# Altium schematic sheet salinity.SchDoc
size A4
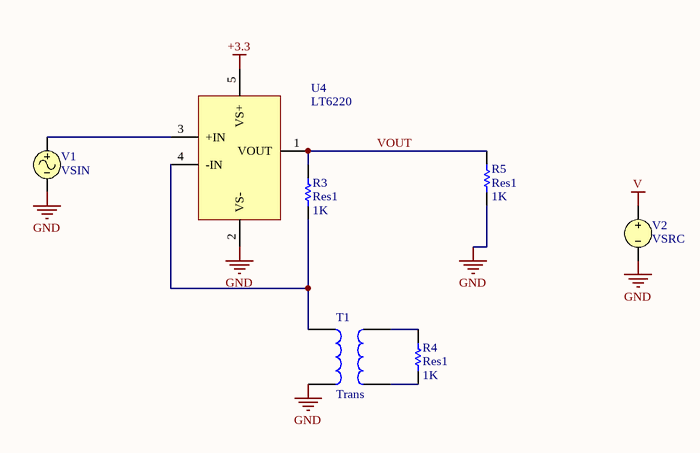
[diagram p0: salinity.SchDoc]

## Parts
R3  Res1  value 1K  [AXIAL-0.3]
R4  Res1  value 1K  [AXIAL-0.3]
R5  Res1  value 1K  [AXIAL-0.3]
T1  Trans  [TRANS]
U4  LT6220
V1  VSIN
V2  VSRC

## Nets
+3.3: U4.5(VS+)
GND: R5.1 T1.2 U4.2(VS-) V1.2 V2.2
V: V2.1
VOUT: R3.2 R5.2 U4.1(VOUT)
NetR3_1: R3.1 T1.1 U4.4(-IN)
NetR4_1: R4.1 T1.4
NetR4_2: R4.2 T1.3
NetU4_3: U4.3(+IN) V1.1

## Library data of the parts
R3-R5 = Res1: Resistor; Published: 8-Jun-2000; LatestRevisionDate: 17-Jul-2002; LatestRevisionNote: Re-released for DXP Platform.; PackageReference: AXIAL-0.3; Publisher: Altium Limited
T1 = Trans: Transformer; Published: 24-Mar-1999; LatestRevisionDate: 08-Jul-2005; LatestRevisionNote: Mech Layer 1 removed.; PackageReference: TRANS; Publisher: Altium Limited
V1 = VSIN: Sinusoidal Voltage Source; Note: PCB Footprint - Not required; Published: 8-Jun-2000; LatestRevisionDate: 15-Nov-2004; LatestRevisionNote: Corrected Netlist.; PackageReference: Not Applicable; Publisher: Altium Limited
V2 = VSRC: Voltage Source; Note: PCB Footprint - Not required; Value: 3.3; Published: 8-Jun-2000; LatestRevisionDate: 17-Jul-2002; LatestRevisionNote: Re-released for DXP Platform.; PackageReference: Not Applicable; Publisher: Altium Limited
U4 = LT6220: farnell: 1663844